# Altium schematic sheet SpeakEasy_POE.SchDoc
size A
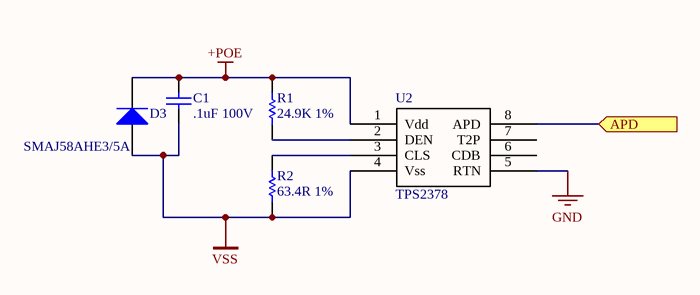
[diagram p0: SpeakEasy_POE.SchDoc]

## Parts
C1  .1uF 100V  [CAPC0603(1608)100_L]
D3  SMAJ58AHE3/5A  [VISH-DO-214AC-2_M]
R1  24.9K 1%  [RESC0603(1608)_L]
R2  63.4R 1%  [RESC0603(1608)_L]
U2  TPS2378  [8SOPWR]

## Ports
APD (in)

## Nets
+POE: C1.1 D3.1(K) R1.2 U2.1(Vdd)
GND: U2.5(RTN)
VSS: C1.2 D3.2(A) R2.1 U2.4(Vss)
APD: U2.8(APD) ; port APD
NetR1_1: R1.1 U2.2(DEN)
NetR2_2: R2.2 U2.3(CLS)

Not connected (* = marked no-connect by the designer): U2 6(CDB) 7(T2P)

## Library data of the parts
C1 = CMP-1590-00005-1: 0.1µF ±10% 100V Ceramic Capacitor X7S 0603 (1608 Metric); Case-Metric: 1608; Case-EIA: 0603; PackageReference: CAPC0603(1608)100
D3 = CMP-0548-00176-1: Transient Voltage Suppressor, 6.40 to 231 V, 58 V Stand-off Voltage, Uni-Directional, -55 to 155 degC, 2-pin DO-214AC, Pb-Free, Tape and Reel; Manufacturer: Vishay Semiconductor; VWM (V): 58; PPPM (W): 400, 300; ID (uA): 1; VBR Uni-Directional (V): 6.4 to 231; IFSM: 40 A; ComponentLink2URL: http://www.vishay.com/docs/88390/smaj50a.pdf; Operating Junction and Storage Temperature Range: -55 to 150 degC; RoHS: TRUE; PackageReference: DO-214AC-2; PackageDescription: 2-Pin DO-214AC (SMA), Body 4.245 x 2.665 mm; ComponentLink1URL: http://www.vishay.com/; PartNumber: SMAJ58AHE3/5A; ComponentLink3Description: Package Specification; ComponentLink3URL: http://www.vishay.com/docs/88390/smaj50a.pdf; Packing: Tape and Reel; Mounting Technology: Surface Mount; DatasheetVersion: 12/8/2013; ComponentLink1Description: Manufacturer URL; ComponentLink2Description: Datasheet
R1 R2 = CMP-1591-00001-1: 0603 (1608 Metric) Chip Resistor; Case-Metric: 1608; Case-EIA: 0603; PackageReference: RESC0603(1608)
U2 = TPS2378: POE Manager IC; ComponentLink1Description: Datasheet; ComponentLink1URL: http://www.ti.com/lit/ds/symlink/tps2378.pdf